# Altium schematic sheet 原理图文档.SchDoc
size A4
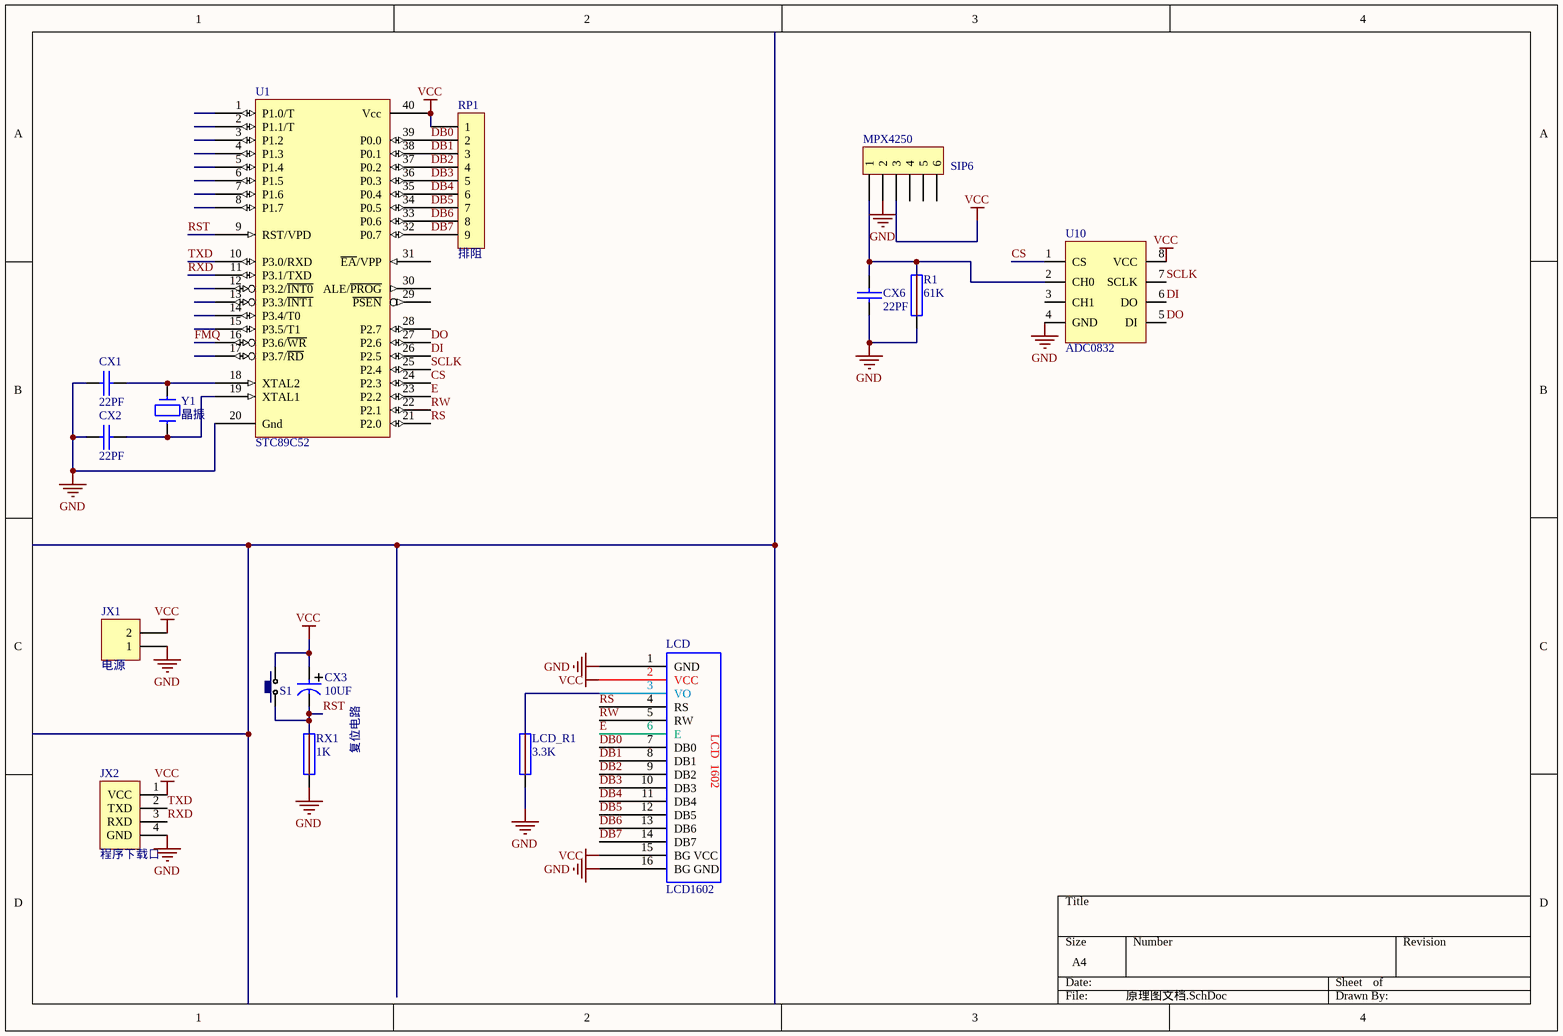
[diagram p0: 原理图文档.SchDoc]

## Parts
CX1  22PF  [电容22]
CX2  22PF  [电容22]
CX3  10UF  [电容10]
CX6  22PF  [电容22]
JX1  电源  [端子]
JX2  程序下载口  [ASIP4]
LCD  LCD1602  [ALCD1602]
LCD_R1  3.3K  [电阻]
MPX4250  SIP6  [ASIP6]
R1  61K  [电阻]
RP1  排阻  [ASIP9]
RX1  1K  [电阻0.3]
S1  按键  [按键]  (value not drawn)
U1  STC89C52  [ADIP40]
U10  ADC0832  [ADIP8]
Y1  晶振  [晶振]

## Nets
GND: CX1.1 CX2.1 CX6.1 JX1.1 JX2.4(GND) LCD.1(GND) LCD.16(BG_GND) LCD_R1.1 MPX4250.2 R1.1 RX1.1 U1.20(Gnd) U10.4(GND)
VCC: CX3.1 JX1.2 JX2.1(VCC) LCD.2(VCC) LCD.15(BG_VCC) MPX4250.3 RP1.1 S1.2 U1.40(Vcc) U10.8(VCC)
CS: U1.24(P2.3) U10.1(CS)
DB0: LCD.7(DB0) RP1.2 U1.39(P0.0)
DB1: LCD.8(DB1) RP1.3 U1.38(P0.1)
DB2: LCD.9(DB2) RP1.4 U1.37(P0.2)
DB3: LCD.10(DB3) RP1.5 U1.36(P0.3)
DB4: LCD.11(DB4) RP1.6 U1.35(P0.4)
DB5: LCD.12(DB5) RP1.7 U1.34(P0.5)
DB6: LCD.13(DB6) RP1.8 U1.33(P0.6)
DB7: LCD.14(DB7) RP1.9 U1.32(P0.7)
DI: U1.26(P2.5) U10.6(DO)
DO: U1.27(P2.6) U10.5(DI)
E: LCD.6(E) U1.23(P2.2)
FMQ: U1.16(P3.6/~{WR})
RS: LCD.4(RS) U1.21(P2.0)
RST: CX3.2 RX1.2 S1.1 U1.9(RST/VPD)
RW: LCD.5(RW) U1.22(P2.1)
RXD: JX2.3(RXD) U1.11(P3.1/TXD)
SCLK: U1.25(P2.4) U10.7(SCLK)
TXD: JX2.2(TXD) U1.10(P3.0/RXD)
NetCX1_2: CX1.2 U1.18(XTAL2) Y1.2
NetCX2_2: CX2.2 U1.19(XTAL1) Y1.1
NetCX6_2: CX6.2 MPX4250.1 R1.2 U10.2(CH0)
NetLCD_3: LCD.3(VO) LCD_R1.2

Not connected (* = marked no-connect by the designer): MPX4250 4 5 6; U1 1(P1.0/T) 2(P1.1/T) 3(P1.2) 4(P1.3) 5(P1.4) 6(P1.5) 7(P1.6) 8(P1.7) 12(P3.2/~{INT0}) 13(P3.3/~{INT1}) 14(P3.4/T0) 15(P3.5/T1) 17(P3.7/~{RD}) 28(P2.7) 29(~{PSEN}) 30(ALE/~{PROG}) 31(~{EA}/VPP); U10 3(CH1)

## Notes on the sheet
- 复位电路
- (in symbol LCD1602) LCD  1602

## Library data of the parts
CX1 CX2 CX6 = 电容22PF: value: 电容22PF
CX3 = 电容10UF: value: 电容10UF
JX1 = 端子: value: 端子
LCD_R1 R1 RX1 = 电阻1K: value: 电阻1K
RP1 = 排阻: value: 排阻10K
U1 = 单片机: value: STC89C52
Y1 = 晶振: value: 晶振11.05926KHZ
JX2 = 程序下载口: value: 程序下载口
LCD = LCD1602: value: LCD1602
MPX4250 = SIP6: VALUE: SIP6
S1 = 按键: value: 按键
U10 = ADC0832: value: ADC0832